# EAGLE schematic Libelle (EAGLE 8.5.1)
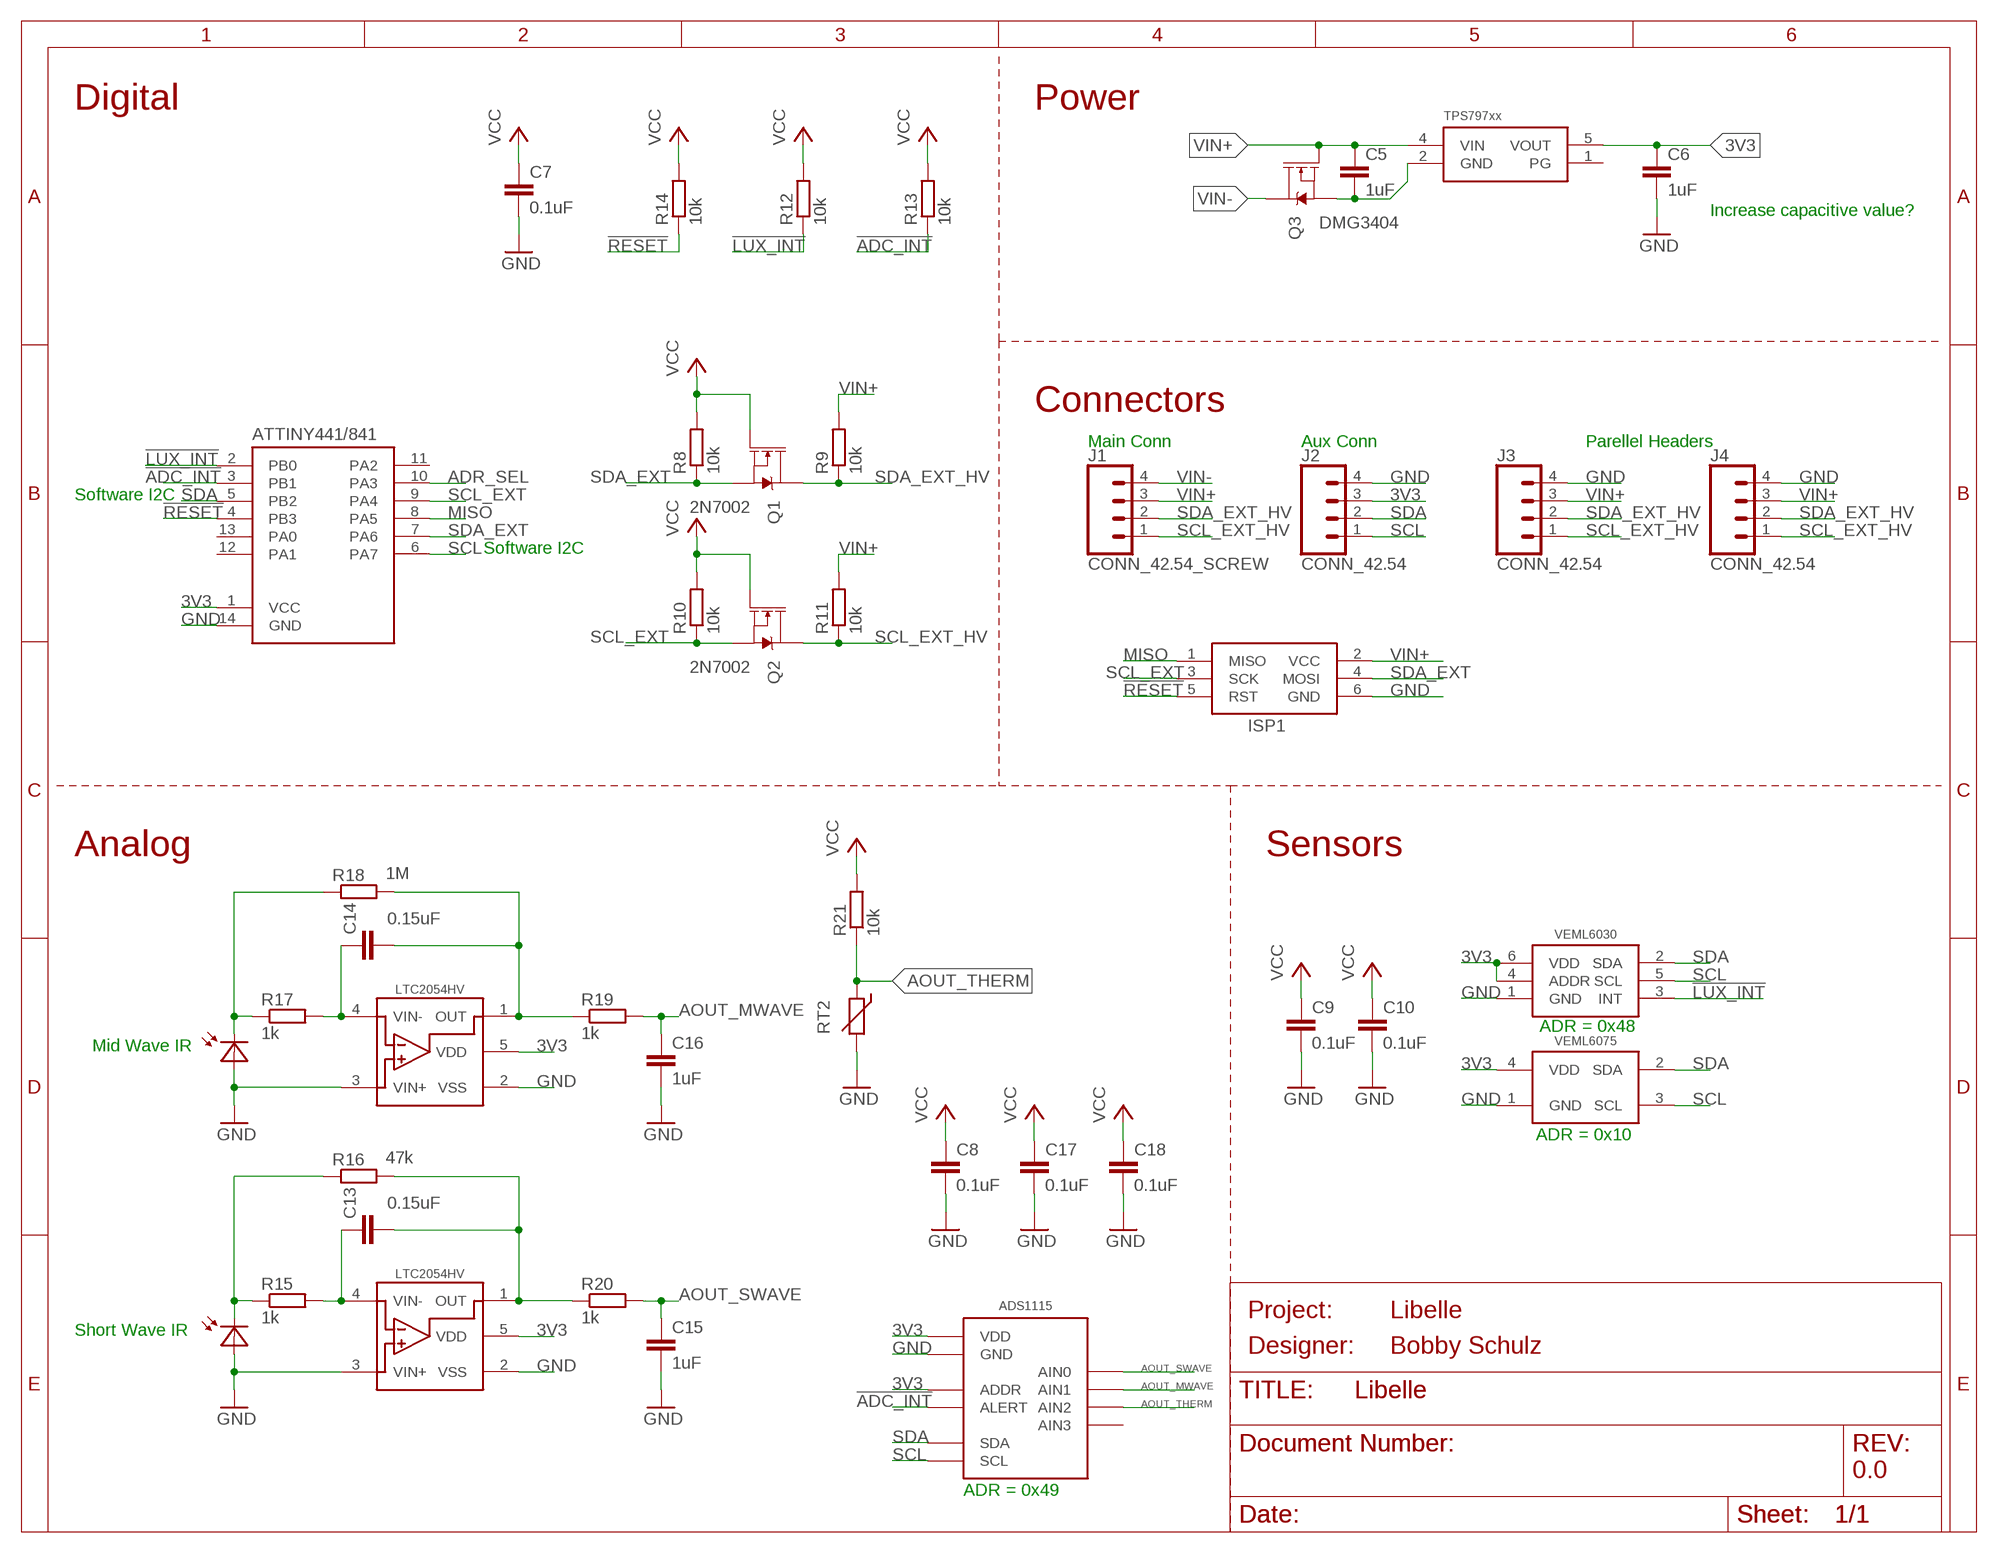
[diagram p0: schematic, sheet 1]
FRAME2 (FRAME_A_L): DESIGNER: Bobby Schulz; PROJECT: Libelle; REV: 0.0

## Parts
ADS1115  ADS1115  [VSSOP_10]
C5  1uF  C-EUC0603  [C0603]
C6  1uF  C-EUC0603  [C0603]
C7  0.1uF  C-EUC0603  [C0603]
C8  0.1uF  C-EUC0603  [C0603]
C9  0.1uF  C-EUC0603  [C0603]
C10  0.1uF  C-EUC0603  [C0603]
C13  0.15uF  C-EUC0603  [C0603]
C14  0.15uF  C-EUC0603  [C0603]
C15  1uF  C-EUC0603  [C0603]
C16  1uF  C-EUC0603  [C0603]
C17  0.1uF  C-EUC0603  [C0603]
C18  0.1uF  C-EUC0603  [C0603]
ISP1  AVRISP-6  [AVRISP]
J1  CONN_42.54_SCREW  [1X04_SCREW]
J2  CONN_42.54  [1X04]
J3  CONN_42.54  [1X04]
J4  CONN_42.54  [1X04]
Q1  2N7002  MOSFET-NCH-2N7002PW  [SOT323]
Q2  2N7002  MOSFET-NCH-2N7002PW  [SOT323]
Q3  DMG3404  MOSFET-NCH-DMG3404L  [SOT23-3]
R8  10k  R-EU_10KR0603  [R0603]
R9  10k  R-EU_10KR0603  [R0603]
R10  10k  R-EU_10KR0603  [R0603]
R11  10k  R-EU_10KR0603  [R0603]
R12  10k  R-EU_10KR0603  [R0603]
R13  10k  R-EU_10KR0603  [R0603]
R14  10k  R-EU_10KR0603  [R0603]
R15  1k  R-EU_R0603  [R0603]
R16  47k  R-EU_R0603  [R0603]
R17  1k  R-EU_R0603  [R0603]
R18  1M  R-EU_R0603  [R0603]
R19  1k  R-EU_R0603  [R0603]
R20  1k  R-EU_R0603  [R0603]
R21  10k  R-EU_R0603  [R0603]
RT2  THERMISTOR10K  [R0603]
U$1  ATTINY441/841841  [SOIC_14]
U$2  VEML6030  [VEML6030]
U$3  VEML6075  [VEML6075]
U$5  TPS79733  [DCK_R-PDSO-G5]
U$9  PHOTODIODEMTD5010W  [TO-18]
U$10  PHOTODIODESD003-151-001  [D1206]
U$11  LTC2054HV  [SOT23-5]
U$12  LTC2054HV  [SOT23-5]

## Nets
3V3: ADS1115.1(ADDR) ADS1115.8(VDD) C6.1 C7.1 C8.1 C9.1 C10.1 C17.1 C18.1 J2.3 Q1.1(G) Q2.1(G) R8.2 R10.2 R12.2 R13.2 R14.2 R21.2 U$1.1(VCC) U$2.4(ADDR) U$2.6(VDD) U$3.4(VDD) U$5.5(VOUT) U$11.5(VDD) U$12.5(VDD) ; supply symbol labelled VCC
!ADC_INT: ADS1115.2(ALERT) R13.1 U$1.3(PB1)
!LUX_INT: R12.1 U$1.2(PB0) U$2.3(INT)
!RESET: ISP1.5(RST) R14.1 U$1.4(PB3)
ADR_SEL: U$1.10(PA3)
AOUT_MWAVE: ADS1115.5(AIN1) C14.2 R18.2 R19.1 U$11.1(OUT)
AOUT_SWAVE: ADS1115.4(AIN0) C13.2 R16.2 R20.1 U$12.1(OUT)
AOUT_THERM: ADS1115.6(AIN2) R21.1 RT2.1
GND: ADS1115.3(GND) C6.2 C7.2 C8.2 C9.2 C10.2 C15.2 C16.2 C17.2 C18.2 ISP1.6(GND) J2.4 J3.4 J4.4 RT2.2 U$1.14(GND) U$2.1(GND) U$3.1(GND) U$9.ANODE(A) U$10.A U$11.2(VSS) U$11.3(VIN+) U$12.2(VSS) U$12.3(VIN+)
MISO: ISP1.1(MISO) U$1.8(PA5)
N$7: C5.2 Q3.2(S) U$5.2(GND)
N$8: C13.1 R15.2 U$12.4(VIN-)
N$9: R15.1 R16.1 U$9.CATHODE(C)
N$10: R17.1 R18.1 U$10.C
N$11: C14.1 R17.2 U$11.4(VIN-)
N$12: C16.1 R19.2
N$13: C15.1 R20.2
SCL: ADS1115.10(SCL) J2.1 U$1.6(PA7) U$2.5(SCL) U$3.3(SCL)
SCL_EXT: ISP1.3(SCK) Q2.2(S) R10.1 U$1.9(PA4)
SCL_EXT_HV: J1.1 J3.1 J4.1 Q2.3(D) R11.1
SDA: ADS1115.9(SDA) J2.2 U$1.5(PB2) U$2.2(SDA) U$3.2(SDA)
SDA_EXT: ISP1.4(MOSI) Q1.2(S) R8.1 U$1.7(PA6)
SDA_EXT_HV: J1.2 J3.2 J4.2 Q1.3(D) R9.1
VIN+: C5.1 ISP1.2(VCC) J1.3 J3.3 J4.3 Q3.1(G) R9.2 R11.2 U$5.4(VIN)
VIN-: J1.4 Q3.3(D)
Unconnected: ADS1115.7(AIN3) U$1.11(PA2) U$1.12(PA1) U$1.13(PA0) U$5.1(PG)

## Notes on the sheet
- Digital | Power
- Increase capacitive value?
- Connectors
- Main Conn | Aux Conn | Parellel Headers
- Software I2C
- Software I2C
- Analog | Sensors
- ADR = 0x48
- Mid Wave IR
- ADR = 0x10
- Short Wave IR
- ADR = 0x49

## Library data of the parts
ADS1115 = bschulz:ADS111*: ADS1115 - Sigma Delta ADC Characteristics: VCC: 2~5.5V Resolution: 16 bits (12 bits for ADS1015) Number of Inputs: 4 (2 Differenital) Sample Rate: 860 Samples Per Second (3300 for ADS1015) Operating Temperature: -40°C to 125°C Digikey: 296-38849-1-ND (ADS1115) <https://www.digikey.com/scripts/DkSearch/dksus.dll?Detail&itemSeq=258904888&uq=636603311183646020> 296-41185-1-ND (ADS1015) <https://www.digikey.com/product-detail/en/texas-instruments/ADS1015IDGSR/296-41185-1-ND/5222640>; DIGIKEY: 296-38849-1-ND; MF: TI; MPN: ADS1115IDGSR
C5-C10 C13-C18 = bschulz_passives:C-EU: CAPACITOR, European symbol
ISP1 = bschulz:AVRISP: AVR ISP HEADER Standard 6 pin header for AVR programming
J1-J4 = bschulz:CONN_4: Genaric 4 pin connector
Q1 Q2 = bschulz:MOSFET-NCH: N-channel MOSFETs Voltage controlled devices that allow control of high current outputs. SparkFun Products: SparkFun OpenScale <https://www.sparkfun.com/products/13261> SparkFun Digital Sandbox <https://www.sparkfun.com/products/12651> SparkFun Monster Moto Shield <https://www.sparkfun.com/products/10182> SparkFun MOSFET Power Controller <https://www.sparkfun.com/products/11214>; DIGIKEY: 2N7002W-FDICT-ND; MF: Diodes Incorporated; MPN: 2N7002W-7-F; PROD_ID: TRANS-11151
Q3 = bschulz:MOSFET-NCH: N-channel MOSFETs Voltage controlled devices that allow control of high current outputs. SparkFun Products: SparkFun OpenScale <https://www.sparkfun.com/products/13261> SparkFun Digital Sandbox <https://www.sparkfun.com/products/12651> SparkFun Monster Moto Shield <https://www.sparkfun.com/products/10182> SparkFun MOSFET Power Controller <https://www.sparkfun.com/products/11214>; DIGIKEY: DMG3404L-7DICT-ND; MF: Diodes Incorporated; MPN: DMG3404L-7
R8-R14 = bschulz_passives:R-EU_: RESISTOR, European symbol; DIGIKEY: 311-10.0KHRCT-ND; MF: Yageo; MPN: RC0603FR-0710KL; VALUE_PART: 10k
R15-R21 = bschulz_passives:R-EU_: RESISTOR, European symbol; MF: Yageo
RT2 = bschulz:THERMISTOR: Thermistor NTC Thermistors: Digikey = 490-12101-1-ND, R25 = 47K, Package = 0603 Digikey = 490-16279-1-ND, R25 = 10K, Package = 0603; DIGIKEY: 490-16279-1-ND; MF: Murata; MPN: NCU18XH103F60RB
U$1 = bschulz:ATTINY441/841: ATTINY441, ATTINY841 8 bit MCU, 4/8k flash, 256/512B SRAM; DIGIKEY: ATTINY841-SSU-ND; MF: Atmel; MPN: ATTINY841-SSU
U$2 = bschulz:VEML6030: VEML6030 - Ambient Light Sensor with I2C Interface Characteristics: VCC: 2.5~3.6V Operating Temperature: -40°C to 85°C Ambient Light Range: 0 ~ 120,000 Lux Digikey: VEML6030-GS15CT-ND <https://www.digikey.com/product-detail/en/vishay-semiconductor-opto-division/VEML6030-GS15/VEML6030-GS15CT-ND/6221151>
U$3 = bschulz:VEML6075: VEML6075 - UVA and UVB Light Sensor with I2C Interface Characteristics: VCC: 1.7~3.6V Operating Temperature: -40°C to 85°C Spectral Range: 300 ~ 400 nm Digikey: VEML6075CT-ND <https://www.digikey.com/scripts/DkSearch/dksus.dll?Detail&itemSeq=258192091&uq=636598415319231969>; DIGIKEY: VEML6075CT-ND; MF: Vishay; MPN: VEML6075
U$5 = bschulz:TPS797*: TPS797xx, Ultra low power linear voltage regulator, fixed voltages of 1.8v, 3v, 3.3v Input voltage rage of 1.8-5.5v; DIGIKEY: 296-11990-1-ND; MF: TI; MPN: TPS79733DCKR
U$9 = bschulz:PHOTODIODE: Photodiode MTD5010W: Spectral Region: Short Wave IR Digikey: 1125-1007-ND <https://www.digikey.com/scripts/DkSearch/dksus.dll?Detail&itemSeq=258192291&uq=636602773549175498> SD003-151-001: Mid Wave IR Digikey: SD003-151-001CT-ND <https://www.digikey.com/scripts/DkSearch/dksus.dll?Detail&itemSeq=258196799&uq=636602773549175498>; DIGIKEY: 1125-1007-ND; MF: Marktech; MPN: MTD5010W
U$10 = bschulz:PHOTODIODE: Photodiode MTD5010W: Spectral Region: Short Wave IR Digikey: 1125-1007-ND <https://www.digikey.com/scripts/DkSearch/dksus.dll?Detail&itemSeq=258192291&uq=636602773549175498> SD003-151-001: Mid Wave IR Digikey: SD003-151-001CT-ND <https://www.digikey.com/scripts/DkSearch/dksus.dll?Detail&itemSeq=258196799&uq=636602773549175498>; DIGIKEY: SD003-151-001CT-ND; MF: Luna Opto; MPN: SD003-151-001
U$11 U$12 = bschulz:LTC2054: LTC2054 -Single Micropower Zero Drift Op-Amp Characteristics: Vs: 2.7 ~ 6V (2.7 ~ +/- 5.5V for LTC2054HV) Iq: 175uA GBP: 500kHz PSSR: 130dB CMMR: 130dB Operating Temperature: -40°C to 85°C Digikey: LTC2054CS5#TRPBFCT-ND <https://www.digikey.com/scripts/DkSearch/dksus.dll?Detail&itemSeq=258611552&uq=636603257096973101> LTC2054HVIS5#TRMPBFCT-ND (High Voltage Variant) <https://www.digikey.com/product-detail/en/linear-technology-analog-devices/LTC2054HVIS5-TRMPBF/LTC2054HVIS5-TRMPBFCT-ND/3830416>; DIGIKEY: LTC2054HVIS5#TRMPBFCT-ND; DISP: LTC2054HV; MF: LT; MPN: LTC2054HVIS5#TRMPBF